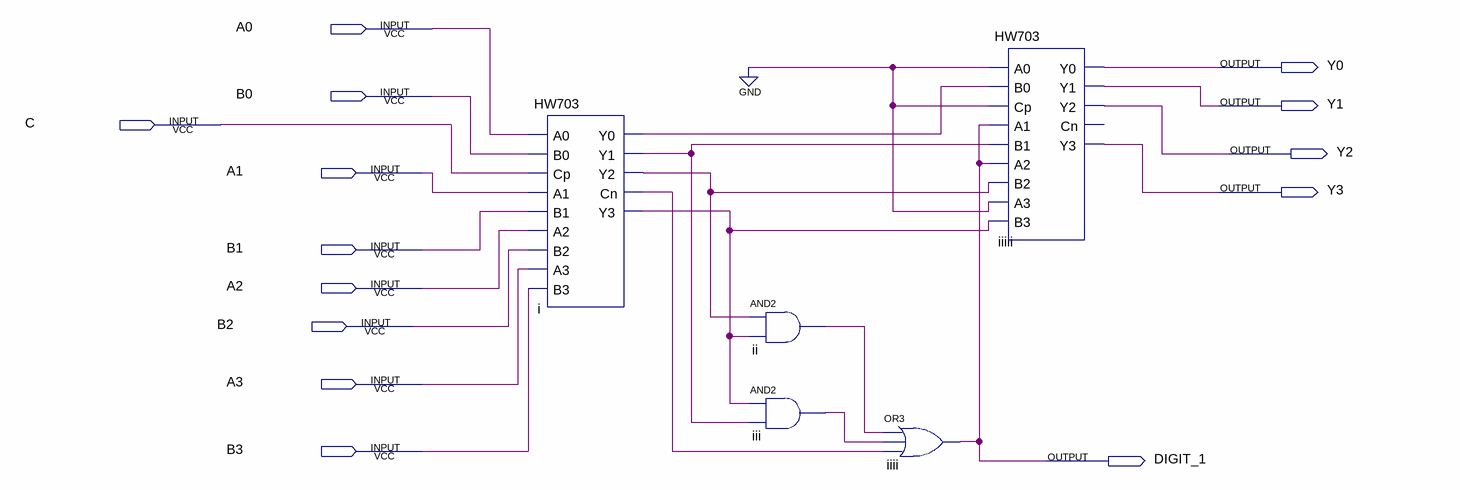
[diagram p0: schematic sheet]
// Quartus schematic BCDadd.bdf as structural Verilog: 5 symbols, 14 pins
module BCDadd (
  input  A0,
  input  B0,
  input  C,
  input  A1,
  input  B1,
  input  A2,
  input  B2,
  input  A3,
  input  B3,
  output Y0,
  output Y1,
  output Y2,
  output Y3,
  output DIGIT_1
);

  wire i_cn, i_y0, i_y1, i_y2, i_y3, ii_out, iii_out;

  HW703 i (
    .A0(A0), .B0(B0), .Cp(C), .A1(A1), .B1(B1), .A2(A2), .B2(B2), .A3(A3), .B3(B3), .Y0(i_y0), .Y1(i_y1),
    .Y2(i_y2), .Cn(i_cn), .Y3(i_y3));
  and ii (ii_out, i_y2, i_y3);
  and iii (iii_out, i_y3, i_y1);
  or iiii (DIGIT_1, ii_out, iii_out, i_cn);
  HW703 iiiii (
    .A0(1'b0), .B0(i_y0), .Cp(1'b0), .A1(DIGIT_1), .B1(i_y1), .A2(DIGIT_1), .B2(i_y2), .A3(1'b0), .B3(i_y3),
    .Y0(Y0), .Y1(Y1), .Y2(Y2), .Y3(Y3));  // open: Cn
endmodule
